# EAGLE design LabPower-power (EAGLE 7.6.0)

## Sheet 1 of 2: HV Side
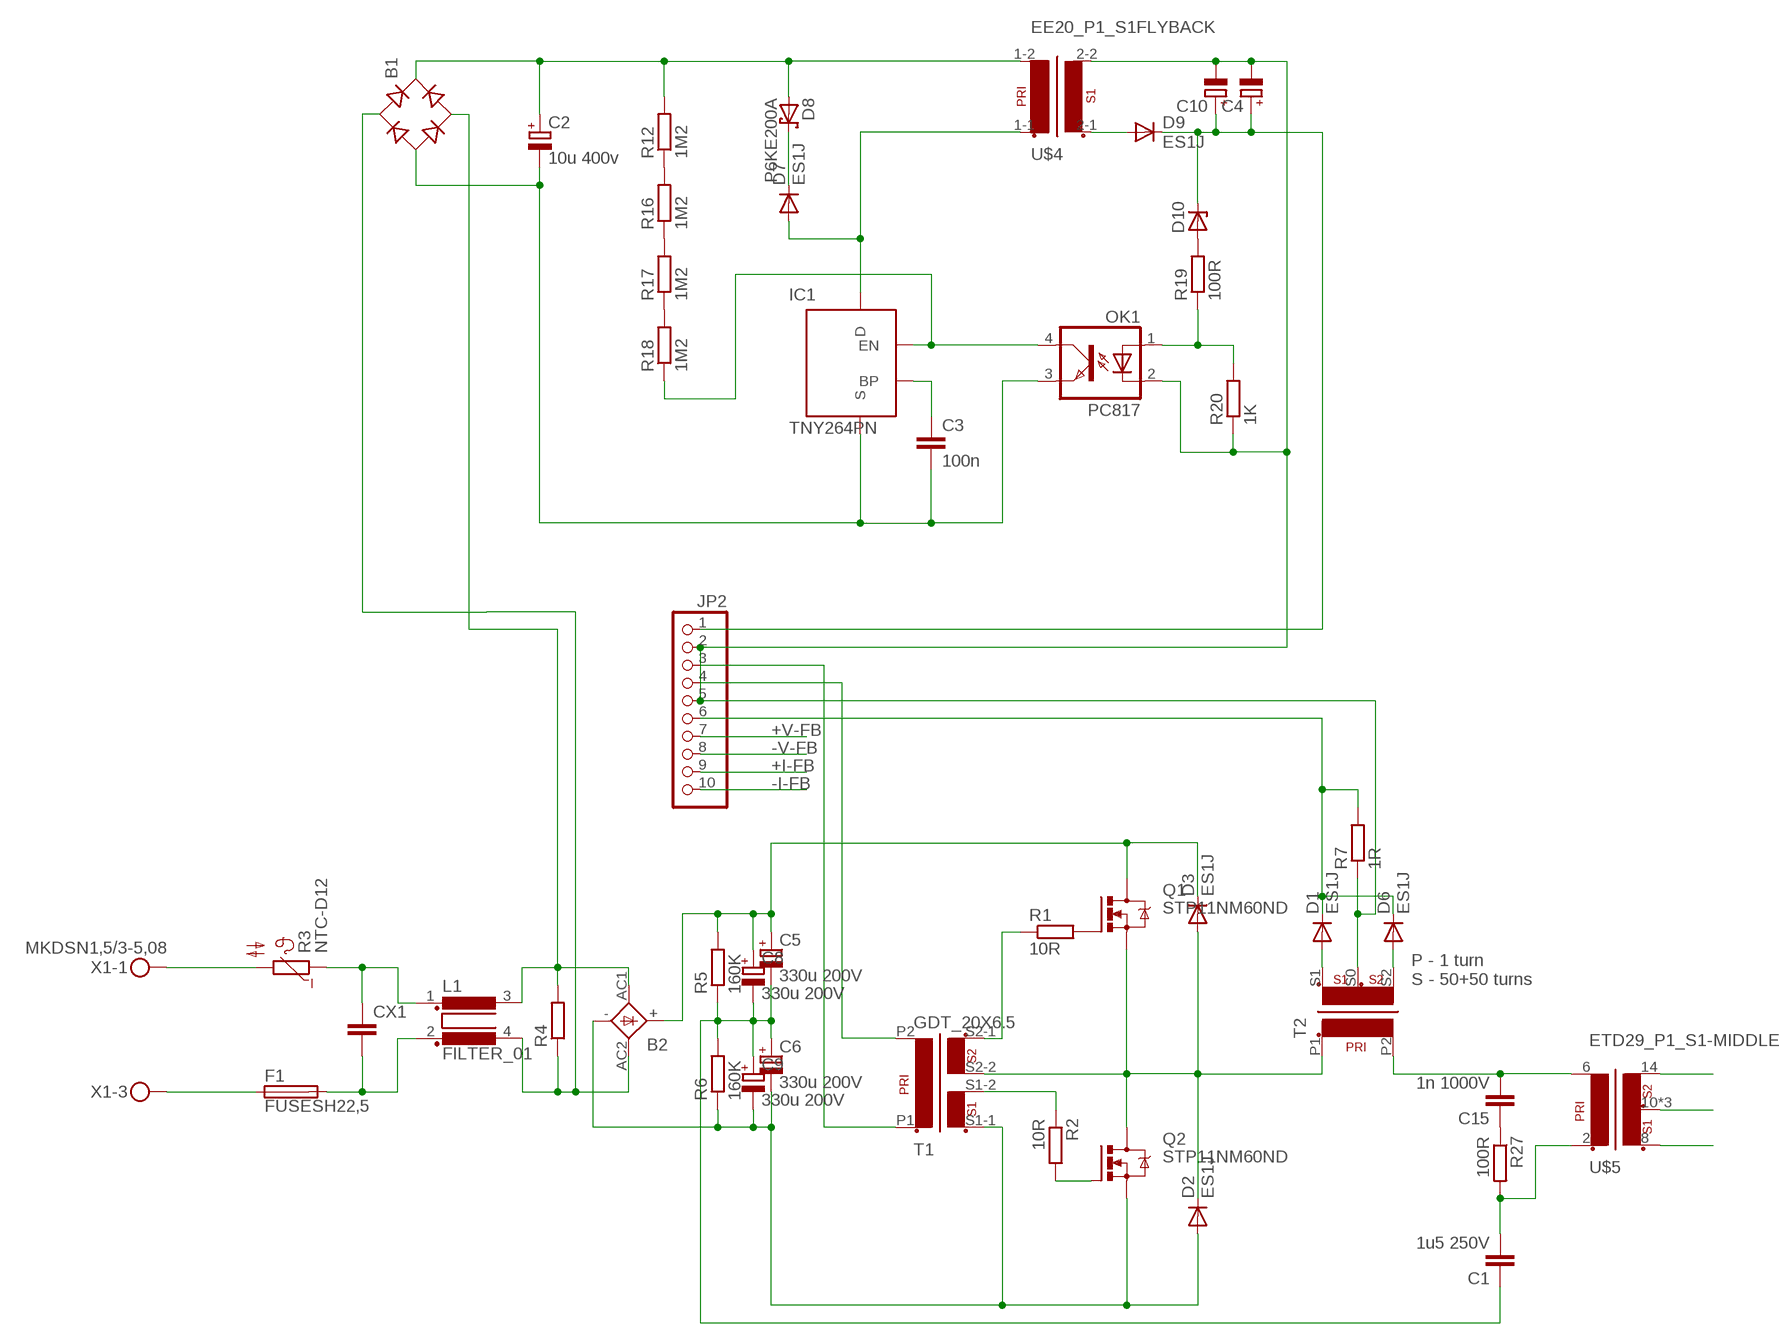
[diagram p0: schematic, sheet 1]

### Parts
B1  RB1A  [RB1A]
B2  KBL  [KBL]
C1  1u5 250V  C-EU225-074X268  [C225-074X268]
C2  10u 400v  CPOL-EUE5-13  [E5-13]
C3  100n  C-EUC0805  [C0805]
C4  CPOL-EUE2.5-7  [E2,5-7]
C5  330u 200V  CPOL-EUE10-22.5  [EB22,5D]
C6  330u 200V  CPOL-EUE10-22.5  [EB22,5D]
C8  330u 200V  CPOL-EUE10-22.5  [EB22,5D]
C9  330u 200V  CPOL-EUE10-22.5  [EB22,5D]
C10  CPOL-EUE2.5-7  [E2,5-7]
C15  1n 1000V  C-EU050-025X075  [C050-025X075]
CX1  CXXC15B8  [XC15B8]
D1  ES1J  DIODE-DO214AC  [DO214AC]
D2  ES1J  DIODE-DO214AC  [DO214AC]
D3  ES1J  DIODE-DO214AC  [DO214AC]
D6  ES1J  DIODE-DO214AC  [DO214AC]
D7  ES1J  DIODE-DO214AC  [DO214AC]
D8  P6KE200A  P6KEXX  [CB417-15]
D9  ES1J  DIODE-DO214AC  [DO214AC]
D10  ZENER-DIODEDO41Z10  [DO41Z10]
F1  FUSESH22,5  [SH22,5]
IC1  TNY264PN  [DIP-8B]
JP2  PINHD-1X10  [1X10]
L1  FILTER_01  [82721K]
OK1  PC817  [DIL04]
Q1  STP11NM60ND  IRF740  [TO220BV]
Q2  STP11NM60ND  IRF740  [TO220BV]
R1  10R  R-EU_R0805  [R0805]
R2  10R  R-EU_R0805  [R0805]
R3  NTC-D12  [NTC-D12]
R4  R-EU_0309/10  [0309/10]
R5  160K  R-EU_0207/12  [0207/12]
R6  160K  R-EU_0207/12  [0207/12]
R7  1R  R-EU_R1206  [R1206]
R12  1M2  R-EU_R0805  [R0805]
R16  1M2  R-EU_R0805  [R0805]
R17  1M2  R-EU_R0805  [R0805]
R18  1M2  R-EU_R0805  [R0805]
R19  100R  R-EU_R0805  [R0805]
R20  1K  R-EU_R0805  [R0805]
R27  100R  R-EU_0617/17  [0617/17]
T1  GDT_20X6.5  [GDT_20X6.5]
T2  CURRENT  [T_10X6X3]
U$4  EE20_P1_S1FLYBACK  [EE20_P1_S1-REV-4PIN]
U$5  ETD29_P1_S1-MIDDLE  [ETD29]
X1  MKDSN1,5/3-5,08  [MKDSN1,5/3-5,08]

### Nets
300V: B2.+ C5.+ C8.+ D3.C Q1.D R5.2
+12: C4.+ C10.+ D9.C D10.C JP2.1 ; also sheet 2
+I-FB: JP2.9 ; also sheet 2
+V-FB: JP2.7 ; also sheet 2
-I-FB: JP2.10 ; also sheet 2
-V-FB: JP2.8 ; also sheet 2
AC1: B1.AC1 B2.AC2(AC1) L1.4 R4.1
AC2: B1.AC2 B2.AC1(AC2) L1.3 R4.2
GND: C4.- C10.- JP2.2 JP2.5 OK1.2(C) R7.1 R20.1 T2.S0(SM) U$4.2-2(S1-2) U$5.10(SM) U$5.11(SM) U$5.12(SM) ; also sheet 2
LOWS+: U$5.14(S2) ; also sheet 2
LOWS-: U$5.8(S1) ; also sheet 2
N$1: C1.1 C5.- C6.+ C8.- C9.+ R5.1 R6.2
N$2: D2.C D3.A Q1.S Q2.D T1.S2-2 T2.P1(P1-1)
N$3: C1.2 R27.2 U$5.2(P1-1)
N$5: C15.2 T2.P2(P1-2) U$5.6(P1-2)
N$6: F1.1 X1.3
N$7: R3.2 X1.1
N$9: CX1.1 L1.1 R3.1
N$10: CX1.2 F1.2 L1.2
N$17: B2.- C6.- C9.- D2.A Q2.S R6.1 T1.S1-1
N$18: JP2.3 T1.P1(P1-1)
N$20: Q1.G R1.2
N$21: Q2.G R2.2
N$22: JP2.4 T1.P2(P1-2)
N$23: R1.1 T1.S2-1
N$24: R2.1 T1.S1-2
N$27: D1.A T2.S1
N$28: D6.A T2.S2
N$30: D1.C D6.C JP2.6 R7.2
N$32: B1.+ C2.+ D8.A R12.2 U$4.1-2
N$33: C15.1 R27.1
N$35: B1.- C2.- C3.2 IC1.2(S) IC1.3(S) IC1.7(S) IC1.8(S) OK1.3(EMIT)
N$36: D7.A IC1.5(D) U$4.1-1
N$38: D7.C D8.C
N$39: C3.1 IC1.1(BP)
N$40: IC1.4(EN) OK1.4(COL) R18.1
N$43: R12.1 R16.2
N$44: R16.1 R17.2
N$45: R17.1 R18.2
N$48: D10.A R19.2
N$49: OK1.1(A) R19.1 R20.2
N$50: D9.A U$4.2-1(S1-1)
Unconnected: X1.2

### Notes on the sheet
- P - 1 turn
  S - 50+50 turns

## Sheet 2 of 2: LV Side
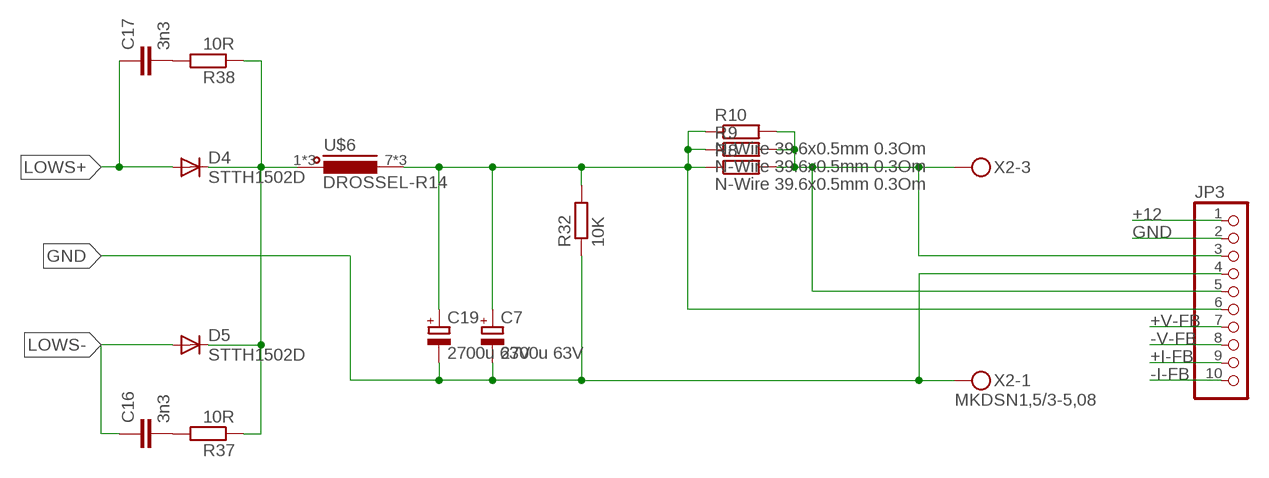
[diagram p1: schematic, sheet 2]

### Parts
C7  2700u 63V  CPOL-EUE7.5-18  [E7,5-18]
C16  3n3  C-EUC0805  [C0805]
C17  3n3  C-EUC0805  [C0805]
C19  2700u 63V  CPOL-EUE7.5-18  [E7,5-18]
D4  STTH1502D  DIODE-DO220S  [DO220S]
D5  STTH1502D  DIODE-DO220S  [DO220S]
JP3  PINHD-1X10  [1X10]
R8  N-Wire 39.6x0.5mm 0.3Om  R-EU_0207/10  [0207/10]
R9  N-Wire 39.6x0.5mm 0.3Om  R-EU_0207/10  [0207/10]
R10  N-Wire 39.6x0.5mm 0.3Om  R-EU_0207/10  [0207/10]
R32  10K  R-EU_0207/10  [0207/10]
R37  10R  R-EU_R0805  [R0805]
R38  10R  R-EU_R0805  [R0805]
U$6  DROSSEL-R14  [RM14]
X2  MKDSN1,5/3-5,08  [MKDSN1,5/3-5,08]

### Nets
+12: JP3.1 ; also sheet 1
+I-FB: JP3.9 ; also sheet 1
+V-FB: JP3.7 ; also sheet 1
-I-FB: JP3.10 ; also sheet 1
-V-FB: JP3.8 ; also sheet 1
CUR+: C7.+ C19.+ JP3.6 R8.1 R9.1 R10.1 R32.2 U$6.7 U$6.8 U$6.9
GND: C7.- C19.- JP3.2 JP3.4 R32.1 X2.1 ; also sheet 1
LOWS+: C17.1 D4.A ; also sheet 1
LOWS-: C16.1 D5.A ; also sheet 1
N$26: D4.C D5.C R37.1 R38.1 U$6.1 U$6.2 U$6.3
N$46: C16.2 R37.2
N$47: C17.2 R38.2
OUT+\CUR-: JP3.3 JP3.5 R8.2 R9.2 R10.2 X2.3
Unconnected: X2.2

## Library data of the parts
B1 = rectifier:RB1A: RECTIFIER 1 A
B2 = rectifier:KBL: DIOTEC RECTIFIER
C1 C3 C15-C17 = rcl:C-EU: CAPACITOR, European symbol
C2 C4-C10 C19 = rcl:CPOL-EU: POLARIZED CAPACITOR, European symbol
CX1 = rcl:CX: X CAPACITOR for power line
D1-D7 D9 = diode:DIODE-: DIODE
D8 = diode:P6KEXX: DIODE transient-voltage suppressor
D10 = diode:ZENER-DIODE: Z-Diode
F1 = fuse:FUSE: Fuse; OC_FARNELL: unknown; OC_NEWARK: unknown
IC1 = Namenlos:TNY264PN
JP2 JP3 = pinhead:PINHD-1X10: PIN HEADER
L1 = _Transformers:FILTER_01
OK1 = optocoupler:PC817: SHARP OPTO COUPLER; MPN: PC817X4J000F; OC_FARNELL: 9707727; OC_NEWARK: 97K7059
Q1 Q2 = transistor-power:IRF740: N-CHANNEL MOS FET
R1 R2 R4-R10 R12 R16-R20 R27 R32 R37 R38 = rcl:R-EU_: RESISTOR, European symbol
R3 = Namenlos:NTC-D12
T1 = _Transformers:GDT_20X6.5
T2 = _Transformers:CURRENT
U$4 = _Transformers:EE20_P1_S1
U$5 = _Transformers:ETD29_P1_S1-MIDDLE
U$6 = _Transformers:DROSSEL-R14
X1 X2 = Namenlos:MKDSN1,5/3-5,08: MKDSN 1,5/ 3-5,08 Printklemme Nennstrom: 13,5 A Nennspannung: 250 V Rastermaß: 5,08 mm Polzahl: 3 Anschlussart: Schraubanschluss Montage: Löten Anschlussrichtung Leiter/Platine: 0 ° Artikelnummer: 1729131 Source: http://eshop.phoenixcontact.com .. 1729131.pdf

## Net classes
0 default: clearance 0.205 mm

## Board
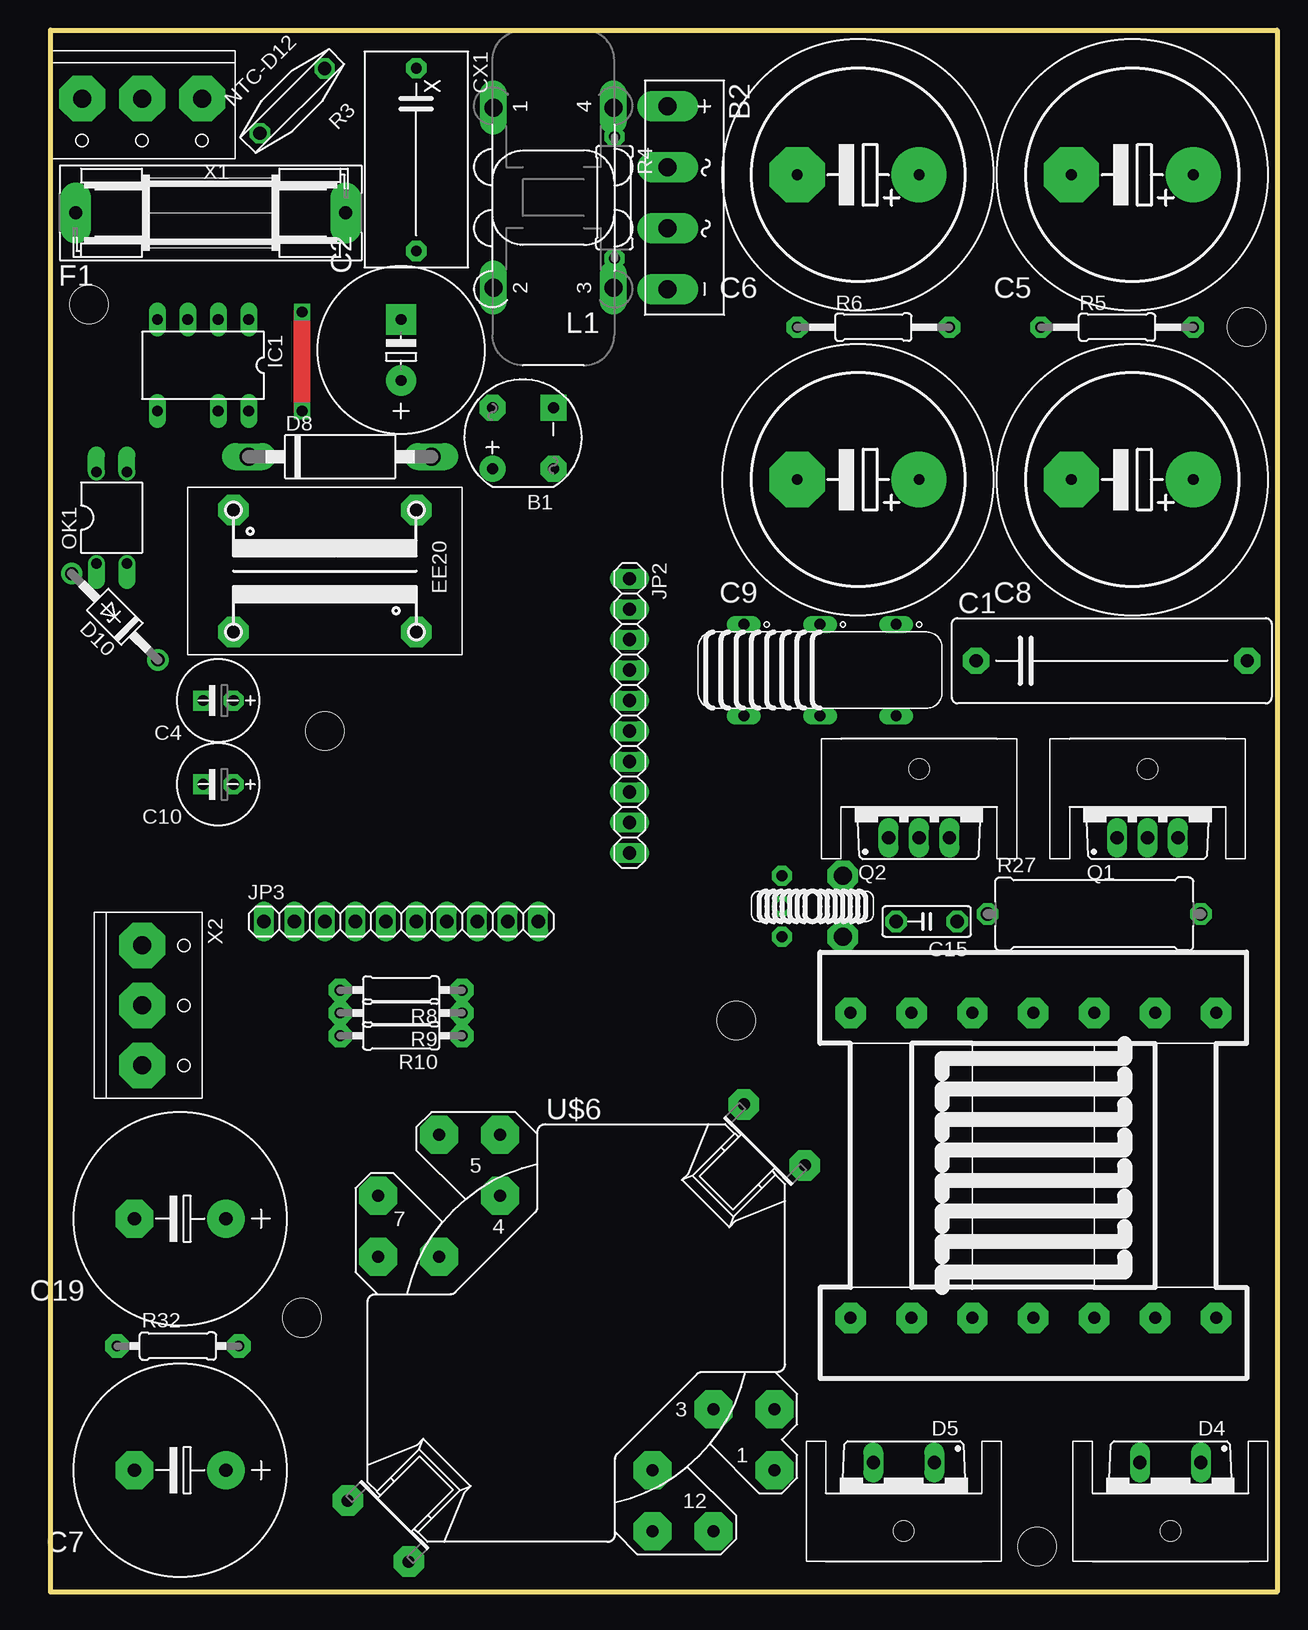
[diagram p2: board, top side]
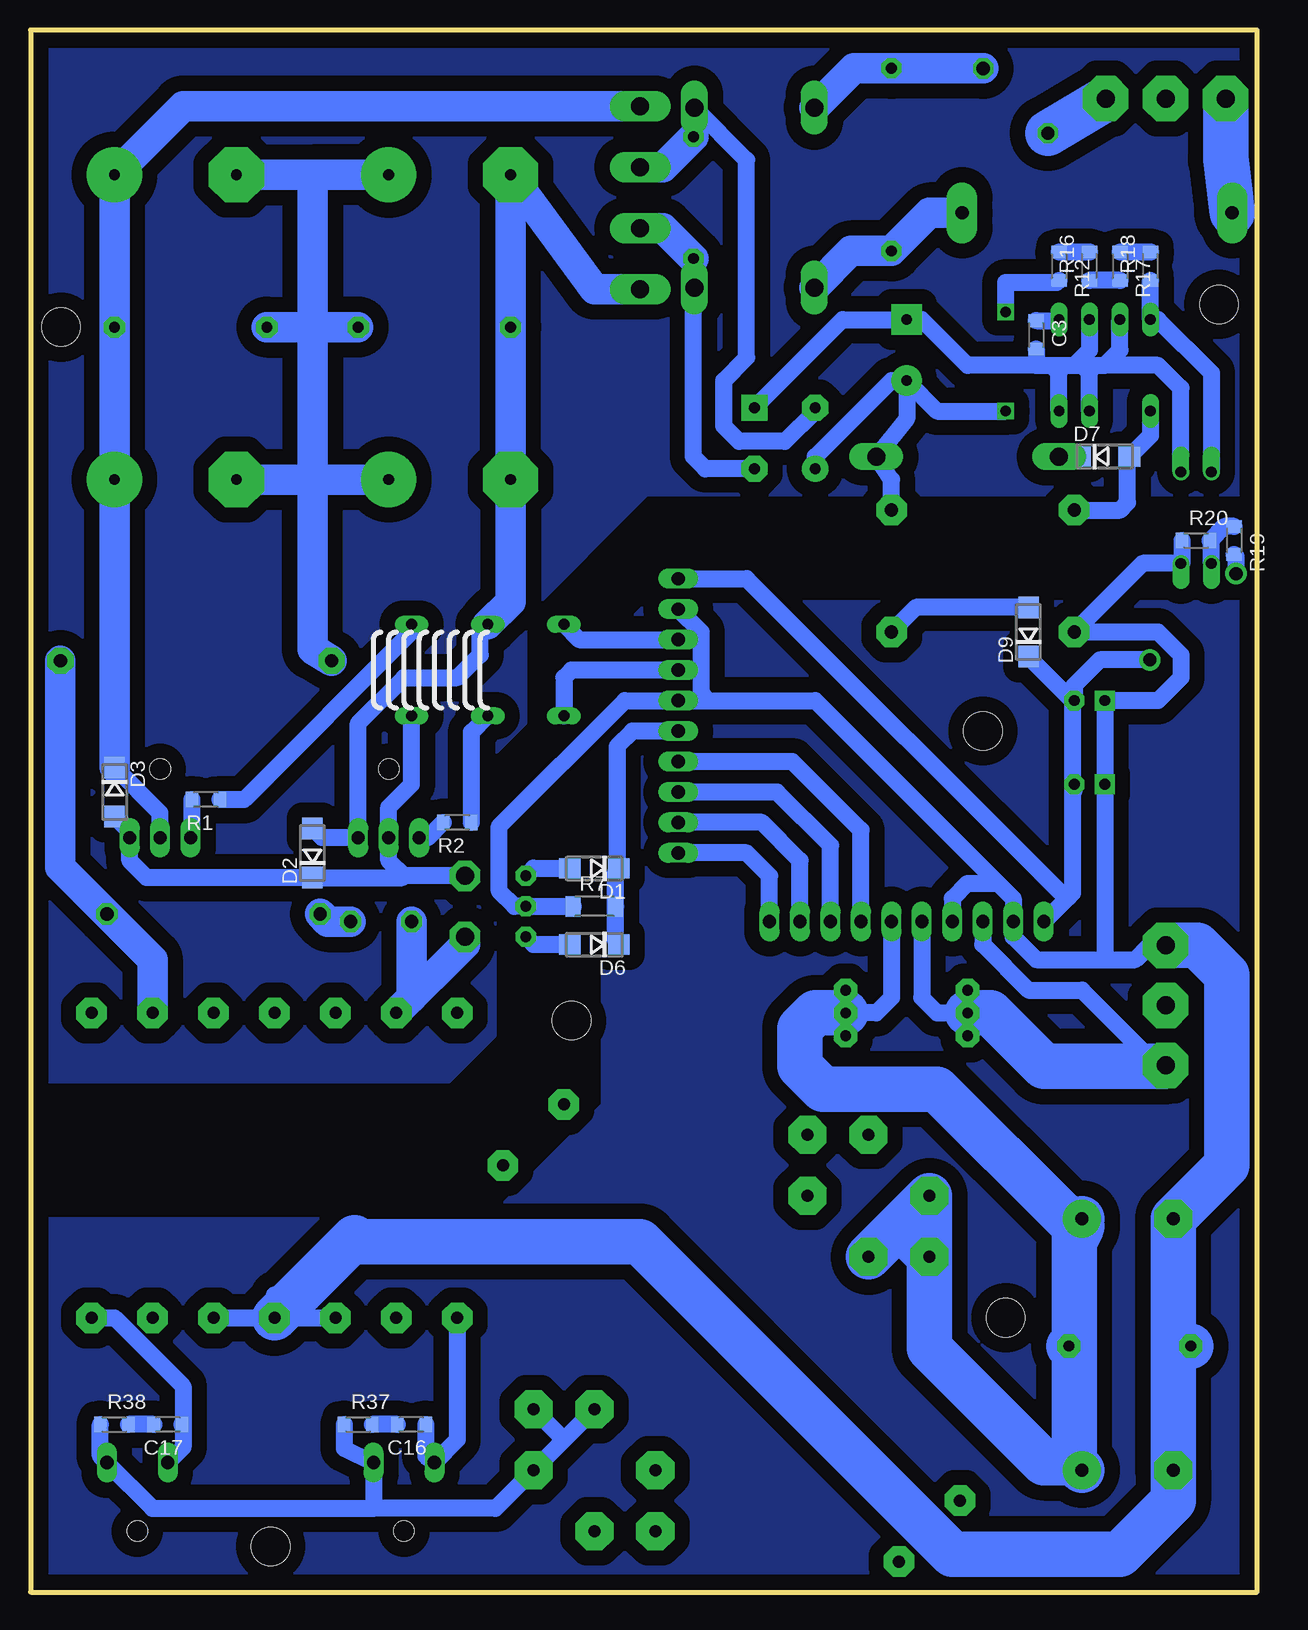
[diagram p3: board, bottom side, seen from below]

Size 102.23 x 130.17 mm. Coordinates in mm from the lower left corner, seen from the top.
Outline: 102.23,130.17 102.23,0 0,0 0,130.17 102.23,130.17
Copper layers (1*16): Top 0.035mm / dielectric 1.5mm / Bottom 0.035mm
Design rules "default *": minimum track width 10mil, minimum drill 24mil, track to track 8mil, track to pad 8mil, pad to pad 8mil, via to via 8mil, smd to smd 8mil, copper to edge 40mil, drill to drill 8mil, minimum pad ring 10mil, minimum via ring 8mil, stop-mask expansion 4mil, vias tented up to drill 0mil, thermal gap 10mil
Holes 3.2 mm at 20.95,22.86 82.23,3.81 3.17,107.31 99.69,105.41 22.86,71.75 57.15,47.62

### Footprints (pad centres in the part's own frame; a part is rotated, then mirrored left to right if it is on the bottom)
RB1A = drill 0.9 pad 2.184: + -2.54,2.54 | drill 0.9 pad 2.184 square: - 2.54,-2.54 | drill 0.9 pad 2.184 octagon: AC1 2.54,2.54; AC2 -2.54,-2.54
KBL = drill 1.5 pad 2.54 long: + -7.62,-1.27; - 7.62,-1.27; AC1 2.54,-1.27; AC2 -2.54,-1.27
C225-074X268 = drill 1.1 pad 2.184 octagon: 1 -11.303,0; 2 11.303,0
E5-13 = drill 0.9 pad 2.54: + -2.54,0 | drill 0.9 pad 2.54 square: - 2.54,0
C0805 = smd 1.05 x 1.3: 1 -1.175,0; 2 1.175,0
E2,5-7 = drill 0.9 pad 1.676 octagon: + -1.27,0 | drill 0.9 pad 1.676 square: - 1.27,0
EB22,5D = drill 0.9 pad 4.597: + -5.08,0 | drill 0.9 pad 4.597 octagon: - 5.08,0
E7,5-18 = drill 1.1 pad 3.15: + -3.81,0 | drill 1.1 pad 3.15 octagon: - 3.81,0
C050-025X075 = drill 1.1 pad 1.778 octagon: 1 -2.54,0; 2 2.54,0
XC15B8 = drill 0.9 pad 1.676 octagon: 1 -7.62,0; 2 7.62,0
DO214AC = smd 1.8 x 1.7: A 2.05,0; C -2.05,0
DO220S = drill 1.1 pad 1.676 long: A 2.54,-2.54; C -2.54,-2.54
CB417-15 = drill 1.5 long: A 7.62,0; C -7.62,0
DO41Z10 = drill 1.1 pad 1.778: A 5.08,0; C -5.08,0
SH22,5 = drill 1.1 pad 2.54 long: 1 -11.252,0; 2 11.252,0
DIP-8B = drill 0.9 long: 1 -3.81,-3.81; 2 -1.27,-3.81; 3 1.27,-3.81; 4 3.81,-3.81; 5 3.81,3.81; 7 -1.27,3.81; 8 -3.81,3.81
1X10 = drill 1.1 long: 1 -11.43,0; 2 -8.89,0; 3 -6.35,0; 4 -3.81,0; 5 -1.27,0; 6 1.27,0; 7 3.81,0; 8 6.35,0; 9 8.89,0; 10 11.43,0
82721K = drill 1.5 long: 1 7.493,5.004; 2 -7.493,5.004; 3 -7.493,-5.004; 4 7.493,-5.004
DIL04 = drill 0.9 pad 1.27 offset: 1 -1.27,-3.81; 2 1.27,-3.81; 3 1.27,3.81; 4 -1.27,3.81
TO220BV = drill 1.1 pad 1.422 long: D 0,-2.54; G -2.54,-2.54; S 2.54,-2.54
R0805 = smd 1.05 x 1.3: 1 -1.175,0; 2 1.175,0
NTC-D12 = drill 1.1 pad 1.676 octagon: 1 -3.81,0; 2 3.81,0
0309/10 = drill 0.9 pad 1.676 octagon: 1 -5.08,0; 2 5.08,0
0207/12 = drill 0.9 pad 1.778 octagon: 1 -6.35,0; 2 6.35,0
R1206 = smd 1.25 x 1.7: 1 -1.775,0; 2 1.775,0
0207/10 = drill 0.9 pad 1.93 octagon: 1 -5.08,0; 2 5.08,0
0617/17 = drill 1.1 pad 1.778 octagon: 1 -8.89,0; 2 8.89,0
GDT_20X6.5 = drill 0.9 long: P1 -6.35,3.81; P2 -6.35,-3.81; S1-1 0,3.81; S1-2 0,-3.81; S2-1 6.35,3.81; S2-2 6.35,-3.81
T_10X6X3 = drill 1.5 pad 2.54 octagon: P1 2.54,2.54; P2 2.54,-2.54 | drill 0.9 pad 1.676 octagon: S0 -2.54,0; S1 -2.54,2.54; S2 -2.54,-2.54
SK95-3M3_HOLE = hole 1.7: 0,3.175
EE20_P1_S1-REV-4PIN = drill 1.1 pad 2.54 octagon: 1-1 -7.62,5.715; 1-2 7.62,5.715; 2-1 7.62,-4.445; 2-2 -7.62,-4.445
ETD29 = drill 1 pad 2.54 octagon: 1 -15.24,-12.7; 2 -10.16,-12.7; 3 -5.08,-12.7; 4 0,-12.7; 5 5.08,-12.7; 6 10.16,-12.7; 7 15.24,-12.7; 8 15.24,12.7; 9 10.16,12.7; 10 5.08,12.7; 11 0,12.7; 12 -5.08,12.7; 13 -10.16,12.7; 14 -15.24,12.7
RM14 = drill 1 pad 3.175 octagon: 1 16.51,-11.43; 2 16.51,-6.35; 3 11.43,-6.35; 4 -6.35,11.43; 5 -6.35,16.51; 6 -11.43,16.51; 7 -16.51,11.43; 8 -16.51,6.35; 9 -11.43,6.35; 10 6.35,-11.43; 11 6.35,-16.51; 12 11.43,-16.51 | drill 1 pad 2.54 octagon: M -19.05,-13.97; M1 -13.97,-19.05; M2 13.97,19.05; M3 19.05,13.97
MKDSN1,5/3-5,08 = drill 1.5 pad 3.81 octagon: 1 -5,0; 2 0,0; 3 5,0

### Placement (x,y rotation side)
B1  39.37,96.15 90 top
B2  52.7,116.2 270 top
C1  88.45,77.61 0 top
C2  29.21,103.5 90 top
C3  18.42,104.77 270 bottom
C4  13.97,74.29 180 top
C5  90.17,118.11 180 top
C6  67.31,118.11 180 top
C7  10.8,10.16 180 top
C8  90.17,92.71 180 top
C9  67.31,92.71 180 top
C10  13.97,67.31 180 top
C15  73.03,55.88 180 top
C16  70.48,13.97 180 bottom
C17  90.81,13.97 180 bottom
C19  10.8,31.11 180 top
CX1  30.48,119.38 270 top
D1  55.24,60.32 180 bottom
D2  78.74,61.59 90 bottom
D3  95.25,66.67 270 bottom
D4  93.34,8.25 180 top
D5  71.12,8.25 180 top
D6  55.24,53.97 180 bottom
D7  12.7,94.61 0 bottom
D8  24.13,94.61 0 top
D9  19.05,80.01 90 bottom
D10  5.34,81.28 135 top
F1  13.33,114.93 0 top
IC1  12.7,102.23 180 top
JP2  48.26,73.02 270 top
JP3  29.21,55.88 0 top
L1  41.91,116.2 90 top
OK1  5.08,89.53 0 top
Q1  91.44,65.4 0 top
Q2  72.39,65.4 0 top
R1  87.63,66.04 180 bottom
R2  66.67,64.13 180 bottom
R3  20.13,124.27 225 top
R4  46.99,116.2 270 top
R5  88.9,105.41 0 top
R6  68.58,105.41 0 top
R7  55.24,57.15 0 bottom
R8  29.21,50.16 180 top
R9  29.21,48.26 180 top
R10  29.21,46.35 180 top
R12  16.51,110.49 270 bottom
R16  13.97,110.49 90 bottom
R17  11.43,110.49 270 bottom
R18  8.89,110.49 90 bottom
R19  1.91,87.63 270 bottom
R20  5.08,87.63 0 bottom
R27  87,56.51 0 top
R32  10.61,20.51 0 top
R37  74.93,13.97 0 bottom
R38  95.25,13.97 0 bottom
T1  64.13,76.83 0 top
T2  63.5,57.15 0 top
U$1  [SK95-3M3_HOLE]  72.39,65.4 0 top
U$3  [SK95-3M3_HOLE]  91.44,65.4 0 top
U$4  22.86,84.45 0 top
U$5  81.91,35.56 180 top
U$6  43.81,21.59 0 top
U$7  [SK95-3M3_HOLE]  93.34,8.25 180 top
U$8  [SK95-3M3_HOLE]  71.12,8.25 180 top
X1  7.62,124.46 180 top
X2  7.62,48.89 270 top

### Tracks (layer width: path | path; a pad name or v marks a point on that pad's centre or on a via)
300V
  Bottom 1.422: Q1.D 91.44,64.91 D3.C
  Bottom 2.54: B2.+ 89.53,123.82 C5.+ R5.2 C8.+ D3.C
+12
  Bottom 1.422: D10.C 13.12,77.69 15.24,75.56 C4.+ 15.39,74.29 | 15.39,74.29 D9.C | 15.39,74.29 15.39,66.67 | 15.39,66.67 15.39,58.27 15.88,57.78 | 15.88,57.78 JP3.1 | JP2.1 42.55,84.45 15.88,57.78 | C10.+ 15.24,66.82 15.39,66.67
+I-FB
  Bottom 1.422: JP3.9 38.1,60.96 41.27,64.13 JP2.9
+V-FB
  Bottom 1.422: JP3.7 33.02,63.5 38.73,69.21 JP2.7
-I-FB
  Bottom 1.422: JP3.10 40.64,59.69 42.55,61.59 JP2.10
-V-FB
  Bottom 1.422: JP3.8 35.56,62.23 40.01,66.67 JP2.8
AC1
  Bottom 1.422: B1.AC1 36.83,98.42 39.37,95.88 43.18,95.88 44.45,97.16 44.45,100.96 42.55,102.87 42.55,119.33 L1.4 46.79,122.55 R4.1
  Bottom 2.54: B2.AC2 49.53,118.74 R4.1
AC2
  Bottom 1.422: B1.AC2 45.98,93.61 46.99,94.61 46.99,108.64 L1.3 47.12,108.71 R4.2
  Bottom 2.54: B2.AC1 49.53,113.66 R4.2
CUR+
  Bottom 1.422: JP3.6 30.48,49.53 31.75,48.26 R9.1 | R8.1 R9.1 | R10.1 R9.1
  Bottom 3.81: U$6.9 29.84,30.48 | 29.84,30.48 U$6.7 27.3,20.32 17.78,10.79 15.24,10.79 | U$6.8 29.84,30.48 | 15.24,10.79 C7.+ | 15.24,10.79 15.24,20.95 | 15.24,20.95 15.24,29.21 | 15.24,29.21 15.24,30.48 | 15.24,30.48 C19.+ | R32.2 | R32.2 15.24,20.95 | 15.24,30.48 15.24,31.11 15.88,31.11 26.67,41.91 36.19,41.91 38.1,43.81 38.1,46.99 36.83,48.26 R9.1 | 15.24,29.21 14.61,30.48 15.24,30.48
GND
  Bottom 1.422: R20.1 6.25,85.82 OK1.2 9.53,85.72 U$4.2-2 8.25,80.01 6.35,78.1 6.35,76.2 8.25,74.29 C4.- C10.- 12.7,52.7 | R7.1 T2.S0 61.91,57.15 63.18,58.42 63.18,63.82 52.7,74.29 JP2.5 45.72,74.29 | U$5.11 U$5.10 | U$5.11 81.91,24.76 | U$5.12 U$5.11 | 21.59,59.05 24.13,59.05 25.4,57.78 JP3.4 | 7.54,53.34 6.98,53.89 | 21.59,59.05 20.32,57.78 JP3.2 20.32,54.61 18.42,52.7 12.7,52.7 | 45.72,74.29 36.83,74.29 21.59,59.05 | JP2.2 46.35,80.01 46.35,74.93 45.72,74.29 | 12.7,52.7 10.16,52.7 8.97,53.89 X2.1
  Bottom 3.81: U$5.11 75.25,29.53 74.93,29.21 51.44,29.21 25.4,3.17 11.43,3.17 6.98,7.62 C7.- 6.98,20.32 | 6.98,20.32 C19.- 2.54,35.56 2.54,51.43 5,53.89 6.98,53.89 X2.1 | R32.1 6.8,20.51 6.98,20.32
LOWS+
  Bottom 1.422: U$5.14 95.25,22.86 89.53,17.14 89.53,13.97 | 89.53,13.97 89.53,12.06 D4.A | C17.1 89.53,13.97
LOWS-
  Bottom 1.422: U$5.8 66.67,12.7 D5.A 69.31,11.33 C16.1
N$1
  Bottom 2.54: C9.+ 78.74,92.71 | 78.74,92.71 C8.- | C5.- 78.74,118.11 | 78.74,118.11 78.74,105.41 | 78.74,105.41 78.74,92.71 | C6.+ 78.74,118.11 | R6.2 78.74,105.41 | R5.1 78.74,105.41 | C1.1 78.74,78.57 78.74,92.71
N$2
  Bottom 1.422: D3.A 93.98,63.35 Q1.S 93.98,60.96 92.56,59.54 D2.C 71.27,59.54 71.12,59.69 | T2.P1 71.12,59.69 | 71.12,59.69 72.39,60.96 Q2.D 72.39,65.4 70.48,67.31 T1.S2-2
N$3
  Bottom 2.54: U$5.2 92.08,52.7 R27.2 99.75,60.38 C1.2
N$4
  pour Bottom (isolate 1.27): 0.64,130.17 102.23,130.17 102.23,42.54 67.31,42.54 63.5,46.35 63.5,69.85 60.96,72.39 60.96,81.28 50.8,91.44 0,91.44 0,129.54
N$5
  Bottom 1.422: 70.48,49.53 U$5.6 | T2.P2 66.04,53.97
  Bottom 2.54: C15.2 70.48,49.53 | 66.04,53.97 U$5.6
N$6
  Bottom 3.81: X1.3 2.62,119.48 F1.1
N$7
  Bottom 3.81: X1.1 R3.2
N$8
  pour Bottom (isolate 1.27): 102.23,0 1.27,0 0,1.27 0,81.91 0.64,82.55 50.8,82.55 54.61,78.74 54.61,40.64 64.13,31.11 100.97,31.11 102.23,29.84
N$9
  Bottom 2.54: R3.1 30.45,126.97 CX1.1 33.6,127 L1.1
N$10
  Bottom 2.54: F1.2 27.3,114.93 CX1.2 33.86,111.76 L1.2
N$17
  Bottom 1.422: D2.A 77.96,62.86 Q2.S 74.93,72.39 71.12,76.2 66.67,76.2 64.77,78.1 64.77,80.01 T1.S1-1
  Bottom 2.54: B2.- 55.24,108.58 61.93,117.7 | 61.93,117.7 C6.- | 61.93,117.7 62.23,117.39 R6.1 C9.- 62.23,82.55 T1.S1-1
N$18
  Bottom 1.422: T1.P1 56.52,79.38 JP2.3
N$20
  Bottom 1.422: R1.2 88.81,62.96 Q1.G
N$21
  Bottom 1.422: Q2.G 69.12,62.86 R2.2
N$22
  Bottom 1.422: JP2.4 57.15,76.83 57.78,76.2 T1.P2
N$23
  Bottom 1.422: T1.S2-1 70.48,80.01 84.45,66.04 R1.1
N$24
  Bottom 1.422: R2.1 65.5,71.66 T1.S1-2
N$26
  Bottom 1.422: R37.1 76.11,11.97 D5.C 73.66,6.98 | R38.1 96.42,11.33 D4.C 92.08,6.98 73.66,6.98 | U$6.3 58.1,12.38 | 58.1,12.38 U$6.1 63.5,6.98 73.66,6.98 | U$6.2 58.1,13.02 58.1,12.38
N$27
  Bottom 1.422: T2.S1 60.33,60.32 D1.A
N$28
  Bottom 1.422: T2.S2 60.33,53.97 D6.A
N$30
  Bottom 1.422: D6.C 53.47,54.25 R7.2 53.47,59.69 | 53.47,59.69 53.47,60.05 D1.C | JP2.6 52.07,71.75 53.34,70.48 53.34,59.82 53.47,59.69
N$32  (via drill 0.9)
  Top 1.422: v20.95,98.42 v20.95,106.68
  Bottom 1.422: C2.+ 26.67,98.42 v20.95,98.42 | v20.95,106.68 20.95,109.12 16.7,109.12 R12.2 | U$4.1-2 30.48,92.71 D8.A 29.21,97.79 C2.+ | B1.+ 36.83,94.61 30.48,100.96 C2.+
N$33
  Bottom 2.54: R27.1 77.47,55.88 C15.1
N$35
  Bottom 1.422: 18.42,102.23 17.14,102.23 | 17.14,102.23 15.24,102.23 | 15.24,102.23 14.61,102.23 | 14.61,102.23 12.7,102.23 | 12.7,102.23 11.43,103.5 IC1.3 | IC1.2 13.97,103.5 15.24,102.23 | IC1.7 13.97,101.6 14.61,102.23 | IC1.8 16.51,101.6 17.14,102.23 | C3.2 18.42,102.23 | OK1.3 6.35,100.33 8.25,102.23 12.7,102.23 | 18.42,102.23 24.13,102.23 27.94,106.04 C2.- 34.55,106.04 B1.-
N$36
  Bottom 1.422: IC1.5 8.89,96.38 D7.A 10.8,94.47 10.8,90.8 11.43,90.17 U$4.1-1
N$38
  Bottom 0.61: D8.C D7.C
N$39
  Bottom 1.422: C3.1 16.61,105.95 IC1.1
N$40
  Bottom 1.422: OK1.4 3.81,101.6 8.25,106.04 IC1.4 R18.1
N$43
  Bottom 1.422: R16.2 R12.1
N$44
  Bottom 1.422: R17.2 R16.1
N$45
  Bottom 1.422: R18.2 R17.1
N$46
  Bottom 1.422: C16.2 R37.2
N$47
  Bottom 1.422: C17.2 R38.2
N$48
  Bottom 1.422: D10.A 1.75,86.3 R19.2
N$49
  Bottom 1.422: OK1.1 3.81,87.53 R20.2 2.73,88.8 R19.1
N$50
  Bottom 1.422: D9.A 28.43,82.06 U$4.2-1
OUT+\CUR-
  Bottom 1.422: JP3.5 27.94,49.53 26.67,48.26 R9.2 | JP3.3 22.86,53.97 19.05,50.16 14.61,50.16 8.25,43.81 | R10.2 R9.2 | R8.2 R9.2
  Bottom 3.81: R9.2 22.22,48.26 17.78,43.81 8.25,43.81 7.7,43.81 X2.3